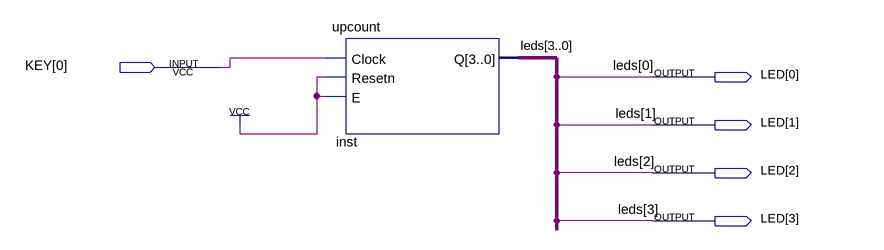
[diagram p0: schematic sheet]
// Quartus schematic sample-01.bdf as structural Verilog: 1 symbols, 5 pins
module \sample-01  (
  input  [0:0] KEY,
  output [3:0] LED
);

  upcount inst (.Clock(KEY[0]), .Resetn(1'b1), .E(1'b1), .Q(LED));

  // Other names for the same wires on the sheet: leds[3:0] = LED
endmodule
